# Altium schematic sheet HMC326.SchDoc
size A4; Organization: Altium Limited; Address1: L3, 12a Rodborough Rd; Address2: Frenchs Forest; Address3: NSW; Address4: Australia 2086; DocumentNumber: 2; SheetNumber: 2; SheetTotal: 7
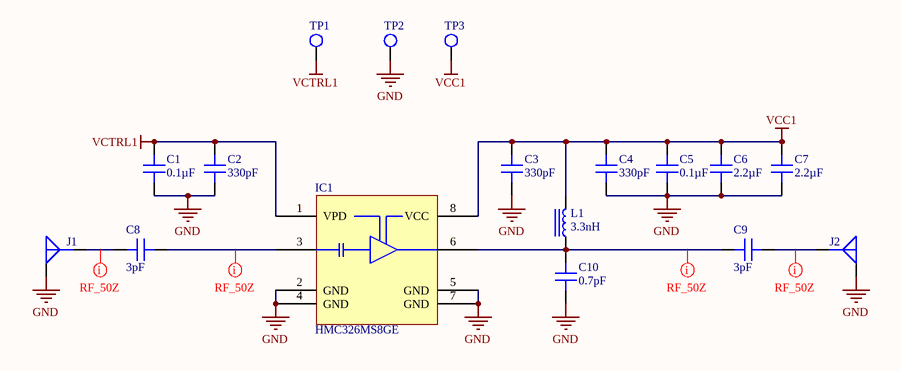
[diagram p0: HMC326.SchDoc]

## Parts
C1  0.1µF  [CAP 0402_1005]
C2  330pF  [CAP 0402_1005]
C3  330pF  [CAP 0402_1005]
C4  330pF  [CAP 0402_1005]
C5  0.1µF  [CAP 0402_1005]
C6  2.2µF  [CAP 0402_1005]
C7  2.2µF  [CAP 0402_1005]
C8  3pF  [CAP 0402_1005 RF]
C9  3pF  [CAP 0402_1005 RF]
C10  0.7pF  [CAP 0402_1005 RF]
IC1  HMC326MS8GE  [ANALOG MSOP8G 3x3MM]
J1  CON-SMA-EDGE-S  [CON-SMA-EDGE-S]  (value not drawn)
J2  CON-SMA-EDGE-S  [CON-SMA-EDGE-S]  (value not drawn)
L1  3.3nH  [0603HP]
TP1  Test Point-THM  [KEYSTONE-THM-TestPoint]  (value not drawn)
TP2  Test Point-THM  [KEYSTONE-THM-TestPoint]  (value not drawn)
TP3  Test Point-THM  [KEYSTONE-THM-TestPoint]  (value not drawn)

## Nets
GND: C1.1 C2.1 C3.1 C4.1 C5.1 C6.1 C7.1 C10.1 IC1.2(GND) IC1.4(GND) IC1.5(GND) IC1.7(GND) J1.2(G) J2.2(G) TP2.1(TP)
VCC1: C3.2 C4.2 C5.2 C6.2 C7.2 IC1.8(VCC) L1.2 TP3.1(TP)
VCTRL1: C1.2 C2.2 IC1.1(VPD) TP1.1(TP)
NetC8_1: C8.1 IC1.3(IN)
NetC8_2: C8.2 J1.1(S)
NetC9_1: C9.1 C10.2 IC1.6(OUT) L1.1
NetC9_2: C9.2 J2.1(S)

## Layout directives
net class RF_50Z: NetC8_1, NetC8_2, NetC9_1, NetC9_2

## Notes on the sheet
- Title
- Author:
- Murat Kucukyilmaz
- Number:
- Date:
- Sheet
- of

## Library data of the parts
C1 C5 = EMK105B7104KV-F: CAP CER 0.1UF 16V X7R 0402; Manufacturer: Taiyo Yuden; Tolerance: ±10%; Part Number: EMK105B7104KV-F; Value: 0.1µF; Applications: General Purpose; Capacitance: 0.1µF; ComponentLink1Description: Datasheet; ComponentLink1URL: https://ds.yuden.co.jp/TYCOMPAS/ut/detail?pn=EMK105B7104KV-F  &u=M; ComponentLink2Description: DigiKey Link; ComponentLink2URL: http://digikey.com/product-detail/en/taiyo-yuden/EMK105B7104KV-F/587-1451-1-ND/1004082; Device Package: 0402 (1005 Metric); LastUpdated: 2.09.2020 01:02:15; Lifecycle Status: Active; Minimum Order: 1; Mounting Type: Surface Mount, MLCC; Operating Temperature: -55°C ~ 125°C; Package / Case: 0402 (1005 Metric); Packaging: CutTape; PartId: 6070; Part Status: Active; Price: 0.10; Series: M; Size / Dimension: 0.039" L x 0.020" W (1.00mm x 0.50mm); Supplier 1: DigiKey; Supplier Part Number 1: 587-1451-1-ND; Temperature Coefficient: X7R; Thickness (Max): 0.022" (0.55mm); Voltage - Rated: 16V
C2-C4 = CL05B331KB5NNNC: CAP CER 330PF 50V X7R 0402; Manufacturer: Samsung Electro-Mechanics; Tolerance: ±10%; Part Number: CL05B331KB5NNNC; Value: 330pF; Applications: General Purpose; Capacitance: 330pF; ComponentLink1Description: Datasheet; ComponentLink1URL: http://www.samsungsem.com/kr/support/product-search/mlcc/CL05B331KB5NNNC.jsp; ComponentLink2Description: DigiKey Link; ComponentLink2URL: http://digikey.com/product-detail/en/samsung-electro-mechanics/CL05B331KB5NNNC/1276-1546-1-ND/3889632; Device Package: 0402 (1005 Metric); LastUpdated: 2.09.2020 01:02:05; Lifecycle Status: Active; Minimum Order: 1; Mounting Type: Surface Mount, MLCC; Operating Temperature: -55°C ~ 125°C; Package / Case: 0402 (1005 Metric); Packaging: TapeAndReel; PartId: 10570; Part Status: Active; Price: 0.01; Series: CL; Size / Dimension: 0.039" L x 0.020" W (1.00mm x 0.50mm); Supplier 1: DigiKey; Supplier Part Number 1: 1276-1546-1-ND; Temperature Coefficient: X7R; Thickness (Max): 0.022" (0.55mm); Voltage - Rated: 50V
C6 C7 = LMK105BJ225MV-F: CAP CER 2.2UF 10V X5R 0402; Manufacturer: Taiyo Yuden; Tolerance: ±20%; Part Number: LMK105BJ225MV-F; Value: 2.2µF; Applications: General Purpose; Capacitance: 2.2µF; ComponentLink1Description: Datasheet; ComponentLink1URL: https://www.yuden.co.jp/productdata/catalog/mlcc01_e.pdf; ComponentLink2Description: DigiKey Link; ComponentLink2URL: http://digikey.com/product-detail/en/taiyo-yuden/LMK105BJ225MV-F/587-3153-1-ND/2774767; Device Package: 0402 (1005 Metric); LastUpdated: 2.09.2020 01:02:21; Lifecycle Status: Active; Minimum Order: 1; Mounting Type: Surface Mount, MLCC; Operating Temperature: -55°C ~ 85°C; Package / Case: 0402 (1005 Metric); Packaging: TapeAndReel; PartId: 3142; Part Status: Active; Price: 0.01; Series: M; Size / Dimension: 0.039" L x 0.020" W (1.00mm x 0.50mm); Supplier 1: DigiKey; Supplier Part Number 1: 587-3153-1-ND; Temperature Coefficient: X5R; Thickness (Max): 0.022" (0.55mm); Voltage - Rated: 10V
C8 C9 = GJM1555C1H3R0CB01J: CAP CER 3PF 50V C0G/NP0 0402; Manufacturer: Murata Electronics; Temperature Coefficient: C0G, NP0; Tolerance: ±0.25pF; Part Number: GJM1555C1H3R0CB01J; Applications: RF, Microwave, High Frequency; Capacitance: 3pF; ComponentLink1Description: Datasheet; ComponentLink1URL: https://search.murata.co.jp/Ceramy/image/img/A01X/G101/ENG/GJM1555C1H3R0CB01-01.pdf; ComponentLink2Description: DigiKey Link; ComponentLink2URL: http://digikey.com/product-detail/en/murata-electronics/GJM1555C1H3R0CB01J/490-8096-1-ND/4380382; Device Package: 0402 (1005 Metric); Features: High Q, Low Loss; LastUpdated: 2.09.2020 01:17:08; Lifecycle Status: Active; Minimum Order: 1; Mounting Type: Surface Mount, MLCC; Operating Temperature: -55°C ~ 125°C; Package / Case: 0402 (1005 Metric); Packaging: TapeAndReel; PartId: 492; Part Status: Active; Price: 0.01; Series: GJM; Size / Dimension: 0.039" L x 0.020" W (1.00mm x 0.50mm); Supplier 1: DigiKey; Supplier Part Number 1: 490-8096-1-ND; Thickness (Max): 0.022" (0.55mm); Value: 3pF; Voltage - Rated: 50V
C10 = GJM1555C1HR70BB01D: CAP CER 0.7PF 50V C0G/NP0 0402; Manufacturer: Murata Electronics; Temperature Coefficient: C0G, NP0; Tolerance: ±0.1pF; Part Number: GJM1555C1HR70BB01D; Applications: RF, Microwave, High Frequency; Capacitance: 0.7pF; ComponentLink1Description: Datasheet; ComponentLink1URL: https://search.murata.co.jp/Ceramy/image/img/A01X/G101/ENG/GJM1555C1HR70BB01-01.pdf; ComponentLink2Description: DigiKey Link; ComponentLink2URL: http://digikey.com/product-detail/en/murata-electronics/GJM1555C1HR70BB01D/490-6079-1-ND/3845279; Device Package: 0402 (1005 Metric); Features: High Q, Low Loss; LastUpdated: 2.09.2020 01:17:05; Lifecycle Status: Active; Minimum Order: 1; Mounting Type: Surface Mount, MLCC; Operating Temperature: -55°C ~ 125°C; Package / Case: 0402 (1005 Metric); Packaging: TapeAndReel; PartId: 1691; Part Status: Active; Price: 0.03; Series: GJM; Size / Dimension: 0.039" L x 0.020" W (1.00mm x 0.50mm); Supplier 1: DigiKey; Supplier Part Number 1: 490-6079-1-ND; Thickness (Max): 0.022" (0.55mm); Value: 0.7pF; Voltage - Rated: 50V
IC1 = HMC326MS8GE: IC RF AMP GP 3GHZ-4.5GHZ 8MSOP; Part Number: HMC326MS8GE; Supplier 1: Digi-Key; Supplier Part Number 1: 1127-1333-ND
J1 J2 = CON-SMA-EDGE-S: CONN SMA JACK STR EDGE MNT; Part Number: CON-SMA-EDGE-S; Supplier 1: Digi-Key; Supplier 2: Mouser; Supplier Part Number 1: CON-SMA-EDGE-S-ND; Supplier Part Number 2: 223-CON-SMA-EDGE-S
L1 = 0603HP-3N3XGLW: Fixed Inductors 0603 3.3nH Unshld 2% 1.9A 24mOhms; Value: 3.3nH; Supplier 1: Mouser; Supplier Part Number 1: 994-0603HP-3N3XGLW
TP1-TP3 = Test Point-THM: THRU HOLE MOUNT TEST POINTS; Supplier 1: Digi-Key; Supplier 2: Mouser; Supplier Part Number 1: 36-5012-ND; Supplier Part Number 2: 534-5012